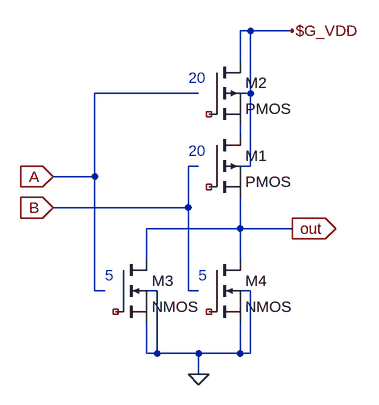
[diagram p0: schematic nor2.asc]
nor2.asc, the LTspice schematic file:
Version 4
SHEET 1 1292 680
WIRE -1024 -512 -1040 -512
WIRE -960 -512 -1024 -512
WIRE -1040 -464 -1040 -512
WIRE -1104 -416 -1264 -416
WIRE -1024 -416 -1024 -512
WIRE -1024 -416 -1040 -416
WIRE -1040 -352 -1040 -368
WIRE -1104 -304 -1120 -304
WIRE -1024 -304 -1024 -416
WIRE -1024 -304 -1040 -304
WIRE -1264 -288 -1264 -416
WIRE -1264 -288 -1328 -288
WIRE -1120 -240 -1120 -304
WIRE -1120 -240 -1328 -240
WIRE -1040 -208 -1040 -256
WIRE -1040 -208 -1184 -208
WIRE -960 -208 -1040 -208
WIRE -1184 -160 -1184 -208
WIRE -1040 -160 -1040 -208
WIRE -1264 -112 -1264 -288
WIRE -1248 -112 -1264 -112
WIRE -1168 -112 -1184 -112
WIRE -1120 -112 -1120 -240
WIRE -1104 -112 -1120 -112
WIRE -1024 -112 -1040 -112
WIRE -1184 -16 -1184 -64
WIRE -1168 -16 -1168 -112
WIRE -1168 -16 -1184 -16
WIRE -1104 -16 -1168 -16
WIRE -1040 -16 -1040 -64
WIRE -1040 -16 -1104 -16
WIRE -1024 -16 -1024 -112
WIRE -1024 -16 -1040 -16
WIRE -1104 16 -1104 -16
FLAG -1104 16 0
FLAG -960 -208 out
IOPIN -960 -208 Out
FLAG -960 -512 $G_VDD
FLAG -1328 -288 A
IOPIN -1328 -288 In
FLAG -1328 -240 B
IOPIN -1328 -240 In
SYMBOL nmos -1088 -160 R0
SYMATTR InstName M4
SYMATTR Value2 l=0.6u w=1.5u
SYMATTR SpiceModel ""
SYMATTR Value NMOS
SYMBOL nmos -1232 -160 R0
SYMATTR InstName M3
SYMATTR Value2 l=0.6u w=1.5u
SYMATTR SpiceModel ""
SYMATTR Value NMOS
SYMBOL pmos -1088 -352 R0
SYMATTR InstName M1
SYMATTR SpiceModel ""
SYMATTR Value PMOS
SYMATTR Value2 l=0.6u w=6u
SYMBOL pmos -1088 -464 R0
SYMATTR InstName M2
SYMATTR SpiceModel ""
SYMATTR Value PMOS
SYMATTR Value2 l=0.6u w=6u
TEXT -1248 -136 Left 0 ;5
TEXT -1104 -136 Left 0 ;5
TEXT -1120 -328 Left 0 ;20
TEXT -1120 -440 Left 0 ;20

The netlist it stands for:
* nor2.asc
* M4: NMOS l=0.6u w=1.5u (symbol nmos not certain, pin order unknown); nets seen at it: 0, out
* M3: NMOS l=0.6u w=1.5u (symbol nmos not certain, pin order unknown); nets seen at it: 0, out
* M1: PMOS l=0.6u w=6u (symbol pmos not certain, pin order unknown); nets seen at it: N001, out
* M2: PMOS l=0.6u w=6u (symbol pmos not certain, pin order unknown); nets seen at it: $G_VDD, N001
* 5
* 5
* 20
* 20
.backanno
.end